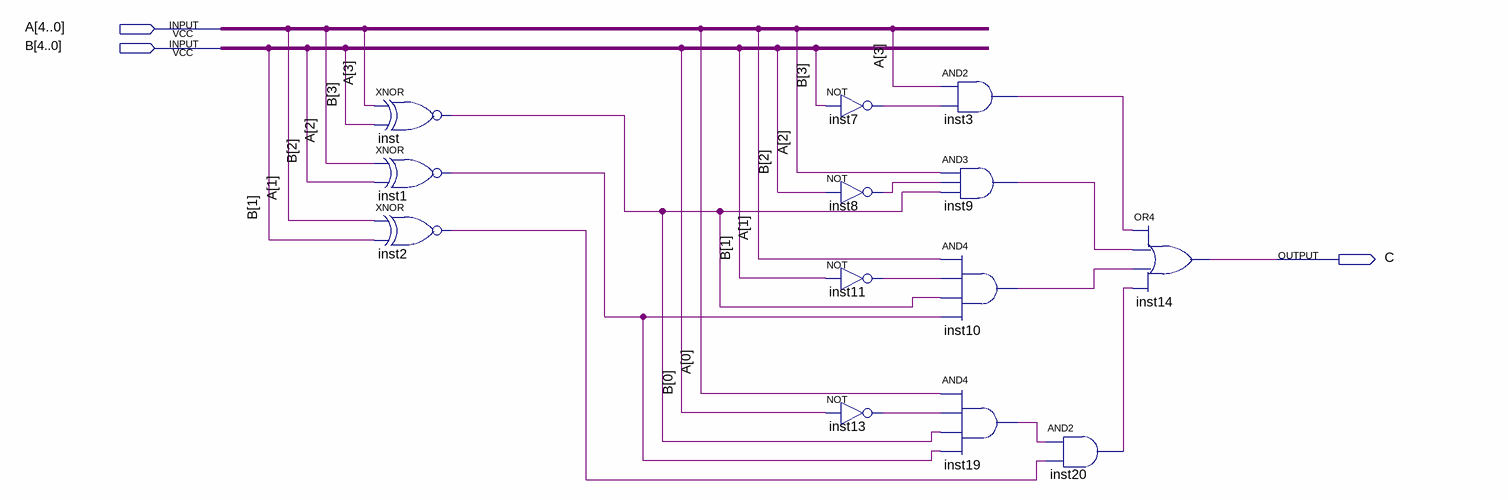
[diagram p0: schematic sheet]
// Quartus schematic greater_comparator_mod.bdf as structural Verilog: 13 symbols, 3 pins
module greater_comparator_mod (
  input  [4:0] A,
  input  [4:0] B,
  output C
);

  wire inst1_out, inst2_out, inst3_out, inst7_out, inst8_out, inst9_out, inst10_out, inst11_out, inst13_out,
       inst19_out, inst20_out, inst_out;

  xnor inst (inst_out, A[3], B[3]);
  xnor inst1 (inst1_out, A[2], B[2]);
  xnor inst2 (inst2_out, A[1], B[1]);
  not inst7 (inst7_out, B[3]);
  not inst8 (inst8_out, B[2]);
  not inst11 (inst11_out, B[1]);
  not inst13 (inst13_out, B[0]);
  and inst3 (inst3_out, A[3], inst7_out);
  and inst9 (inst9_out, A[2], inst8_out, inst_out);
  and inst10 (inst10_out, A[1], inst11_out, inst_out, inst1_out);
  and inst19 (inst19_out, A[0], inst13_out, inst_out, inst1_out);
  and inst20 (inst20_out, inst19_out, inst2_out);
  or inst14 (C, inst3_out, inst9_out, inst10_out, inst20_out);
endmodule
